# EAGLE design DOORLOCK_alter (EAGLE 7.5.0)

## Sheet 1 of 2
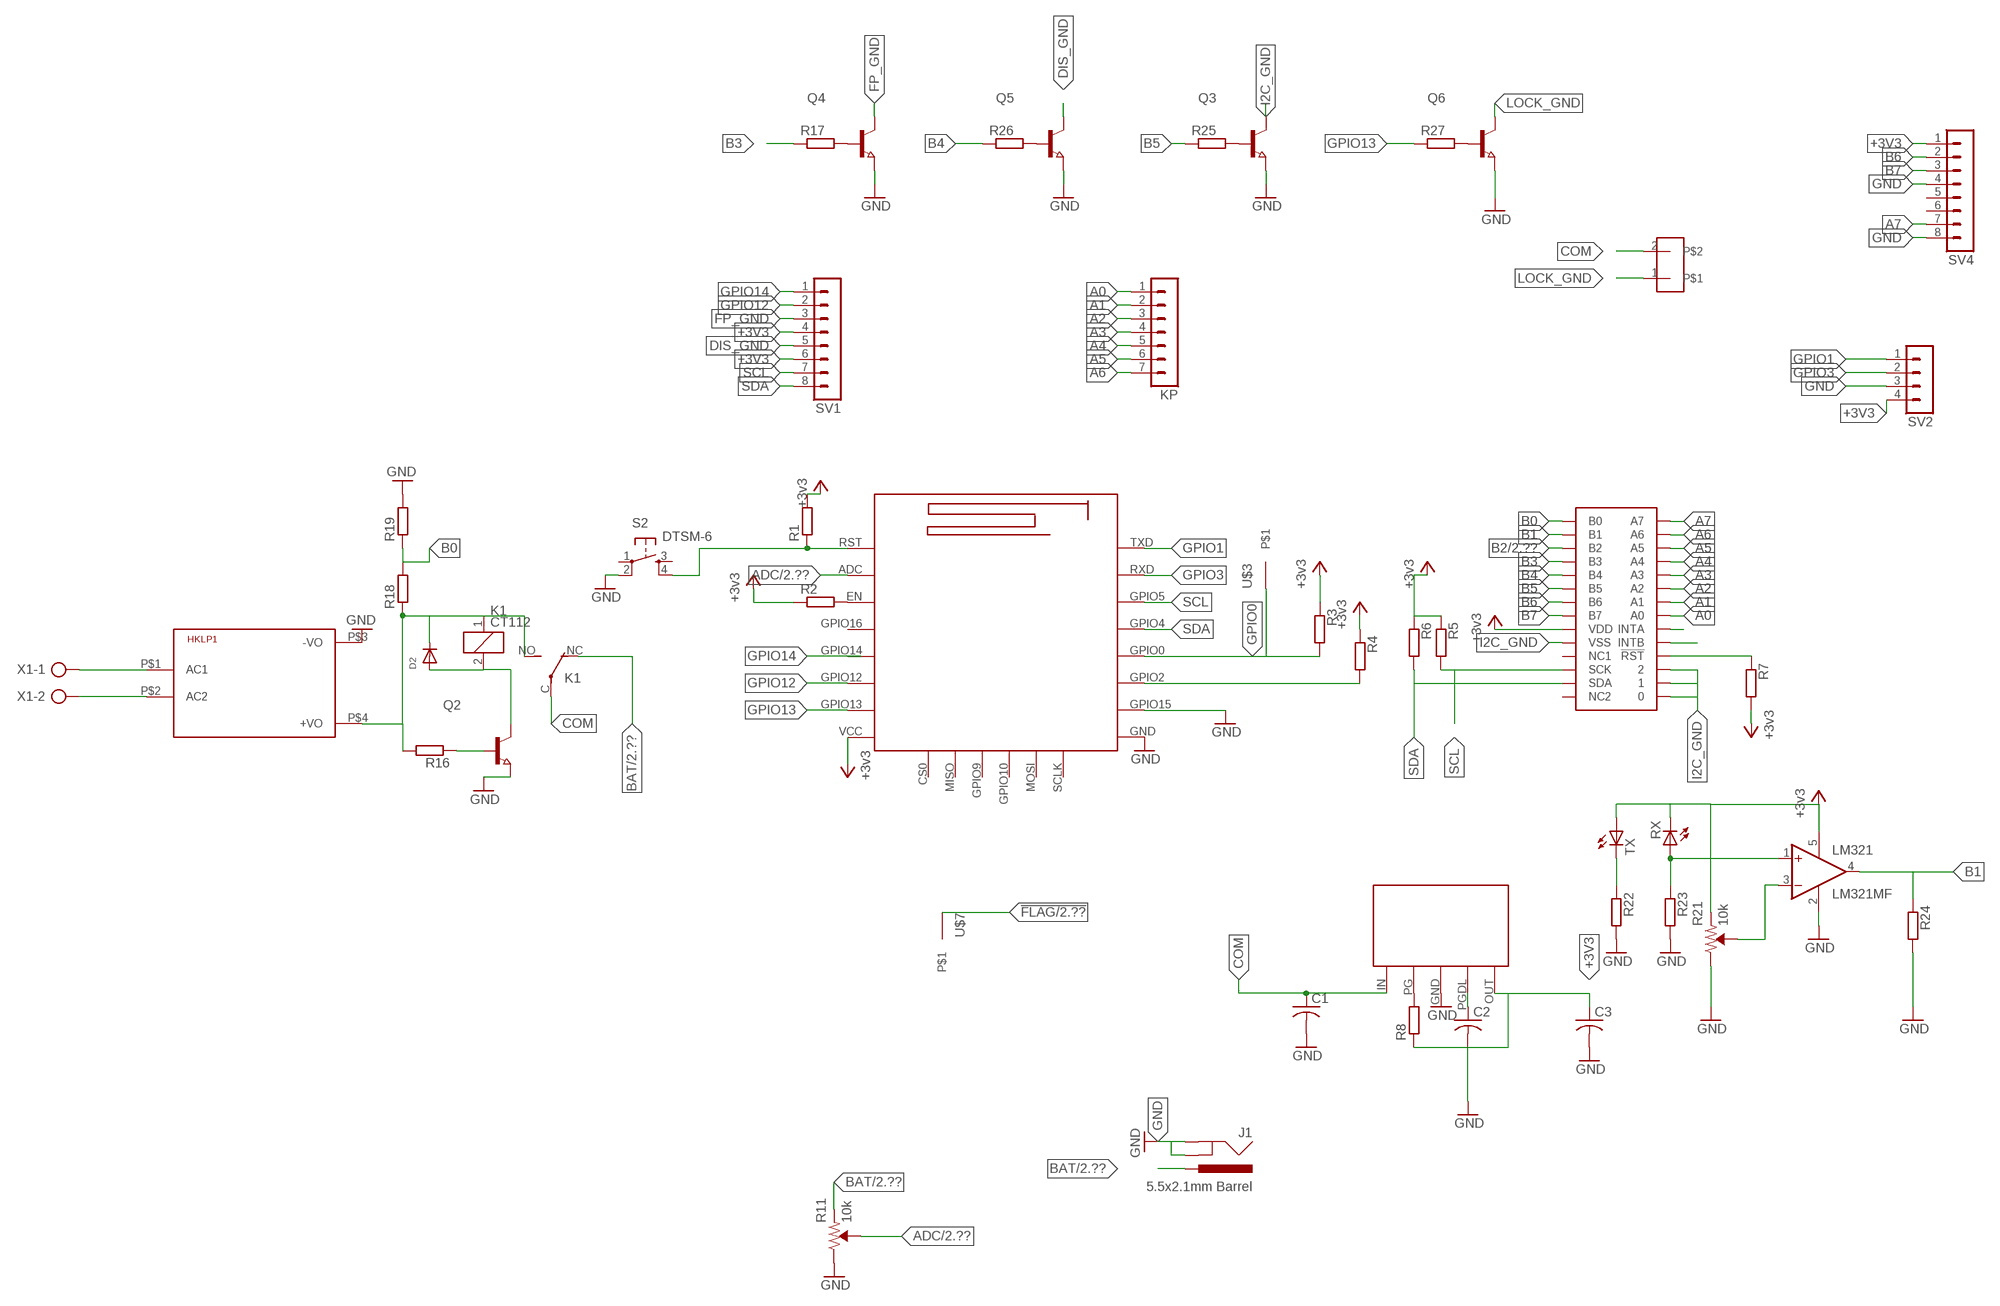
[diagram p0: schematic, sheet 1]

### Parts
C1  C-USC1206  [C1206]
C2  C-USC1206  [C1206]
C3  C-USC1206  [C1206]
D2  DIODESOD-123  [SOD-123]
HKLP1  HKLPM01  [HKLPM01]
J1  5.5x2.1mm Barrel  POWER_JACKSMD  [POWER_JACK_SMD]
K1  CT112  [CT-SLIM]
KP  MA07-1  [MA07-1]
LM321  LM321MF  [SOT23-5]
MP2014  MP2014  [MP2014]
Q2  NPN-TRANSISTOR_SOT89  [SOT89]
Q3  NPN-TRANSISTOR_SOT89  [SOT89]
Q4  NPN-TRANSISTOR_SOT89  [SOT89]
Q5  NPN-TRANSISTOR_SOT89  [SOT89]
Q6  NPN-TRANSISTOR_SOT89  [SOT89]
R1  R-EU_0204/2V  [0204V]
R2  R-EU_0204/2V  [0204V]
R3  R-EU_0204/2V  [0204V]
R4  R-EU_0204/2V  [0204V]
R5  R-EU_0204/2V  [0204V]
R6  R-EU_0204/2V  [0204V]
R7  R-EU_0204/2V  [0204V]
R8  R-EU_0204/2V  [0204V]
R11  10k  TRIMPOT-SMD-3MM-OPEN-1/10W-25%  [TRIMPOT-SMD-TC33X]
R16  R-EU_0204/2V  [0204V]
R17  R-EU_0204/2V  [0204V]
R18  R-EU_0204/2V  [0204V]
R19  R-EU_0204/2V  [0204V]
R21  10k  TRIMPOT-SMD-3MM-OPEN-1/10W-25%  [TRIMPOT-SMD-TC33X]
R22  R-EU_0204/2V  [0204V]
R23  R-EU_0204/2V  [0204V]
R24  R-EU_0204/2V  [0204V]
R25  R-EU_0204/2V  [0204V]
R26  R-EU_0204/2V  [0204V]
R27  R-EU_0204/2V  [0204V]
RX  LED5MM  [LED5MM]
S2  DTSM-6  [DTSM-6]
SV1  MA08-1  [MA08-1]
SV2  MA04-1  [MA04-1]
SV4  MA08-1  [MA08-1]
TX  LED5MM  [LED5MM]
U$1  ESP12E  [ESP-12E]
U$2  MCF23017  [MAX23017]
U$3  M1  [M1]
U$4  MALE2PIN  [MALE2PIN]
U$7  M1  [M1]
X1  AK500/2-H  [AK500/2-H]

### Nets
!FLAG [GPIO]: U$7.P$1 ; also sheet 2
+3V3 [GPIO]: C3.1 LM321.5(V+) MP2014.OUT R1.2 R2.1 R3.1 R4.1 R5.1 R6.1 R7.2 R8.1 R21.3(CCW) RX.K(C) SV1.4 SV1.6 SV2.4 SV4.1 TX.A U$1.VCC U$2.P$9(VDD) ; supply symbol labelled +3v3
+12V: D2.C HKLP1.P$4(+VO) K1.1 K1.NO(2:S) R16.2 R18.1 ; also sheet 2
A0 [GPIO]: KP.1 U$2.P$21(A0)
A1 [GPIO]: KP.2 U$2.P$22(A1)
A2 [GPIO]: KP.3 U$2.P$23(A2)
A3 [GPIO]: KP.4 U$2.P$24(A3)
A4 [GPIO]: KP.5 U$2.P$25(A4)
A5 [GPIO]: KP.6 U$2.P$26(A5)
A6 [GPIO]: KP.7 U$2.P$27(A6)
A7 [GPIO]: SV4.7 U$2.P$28(A7)
ADC [GPIO]: R11.2(WIPER) U$1.ADC ; also sheet 2
B0 [GPIO]: R18.2 R19.1 U$2.P$1(B0)
B1 [GPIO]: LM321.4(OUT) R24.1 U$2.P$2(B1)
B2 [GPIO]: U$2.P$3(B2) ; also sheet 2
B3 [GPIO]: R17.1 U$2.P$4(B3)
B4 [GPIO]: R26.1 U$2.P$5(B4)
B5 [GPIO]: R25.1 U$2.P$6(B5)
B6 [GPIO]: SV4.2 U$2.P$7(B6)
B7 [GPIO]: SV4.3 U$2.P$8(B7)
BAT [GPIO]: J1.VIN0(PWR) K1.NC(2:O) R11.3(CCW) ; also sheet 2
COM: C1.1 K1.C(2:P) MP2014.IN U$4.2
DIS_GND [GPIO]: Q5.2(C) SV1.5
FP_GND [GPIO]: Q4.2(C) SV1.3
GND [GPIO]: C1.2 C2.2 C3.2 HKLP1.P$3(-VO) J1.GND(GNDBREAK) J1.P$4(GND) LM321.2(V-) MP2014.GND Q2.3(E) Q3.3(E) Q4.3(E) Q5.3(E) Q6.3(E) R11.1(CW) R19.2 R21.1(CW) R22.2 R23.2 R24.2 S2.2 SV2.3 SV4.4 SV4.8 U$1.GND U$1.GPIO15 ; also sheet 2
GPIO0 [GPIO]: R3.2 U$1.GPIO0 U$3.P$1
GPIO1 [GPIO]: SV2.1 U$1.TXD
GPIO3 [GPIO]: SV2.2 U$1.RXD
GPIO12 [GPIO]: SV1.2 U$1.GPIO12
GPIO13 [GPIO]: R27.1 U$1.GPIO13
GPIO14 [GPIO]: SV1.1 U$1.GPIO14
I2C_GND [GPIO]: Q3.2(C) U$2.P$10(VSS) U$2.P$15 U$2.P$16 U$2.P$17
LOCK_GND: Q6.2(C) U$4.1
N$1 [GPIO]: R1.1 S2.4 U$1.RST
N$2: R2.2 U$1.EN
N$3 [AC]: HKLP1.P$1(AC1) X1.1
N$4 [GPIO]: R4.2 U$1.GPIO2
N$5 [GPIO]: LM321.3(-IN) R21.2(WIPER)
N$6: Q3.1(B) R25.2
N$7 [AC]: HKLP1.P$2(AC2) X1.2
N$9: R7.1 U$2.P$18(!RST)
N$10: U$2.P$19(INTB)
N$11: U$2.P$20(INTA)
N$12: MP2014.PG R8.2
N$13: C2.1 MP2014.PGDL
N$15: Q2.1(B) R16.1
N$16: Q6.1(B) R27.2
N$26: D2.A K1.2 Q2.2(C)
N$28: Q4.1(B) R17.2
N$30 [GPIO]: R22.1 TX.K(C)
N$31: Q5.1(B) R26.2
N$33 [GPIO]: LM321.1(+IN) R23.1 RX.A
SCL [GPIO]: R5.2 SV1.7 U$1.GPIO5 U$2.P$12(SCK)
SDA [GPIO]: R6.2 SV1.8 U$1.GPIO4 U$2.P$13(SDA)
Unconnected: S2.1 S2.3 SV4.5 SV4.6 U$1.CS0 U$1.GPIO9 U$1.GPIO10 U$1.GPIO16 U$1.MISO U$1.MOSI U$1.SCLK U$2.P$11(NC1) U$2.P$14(NC2)

## Sheet 2 of 2
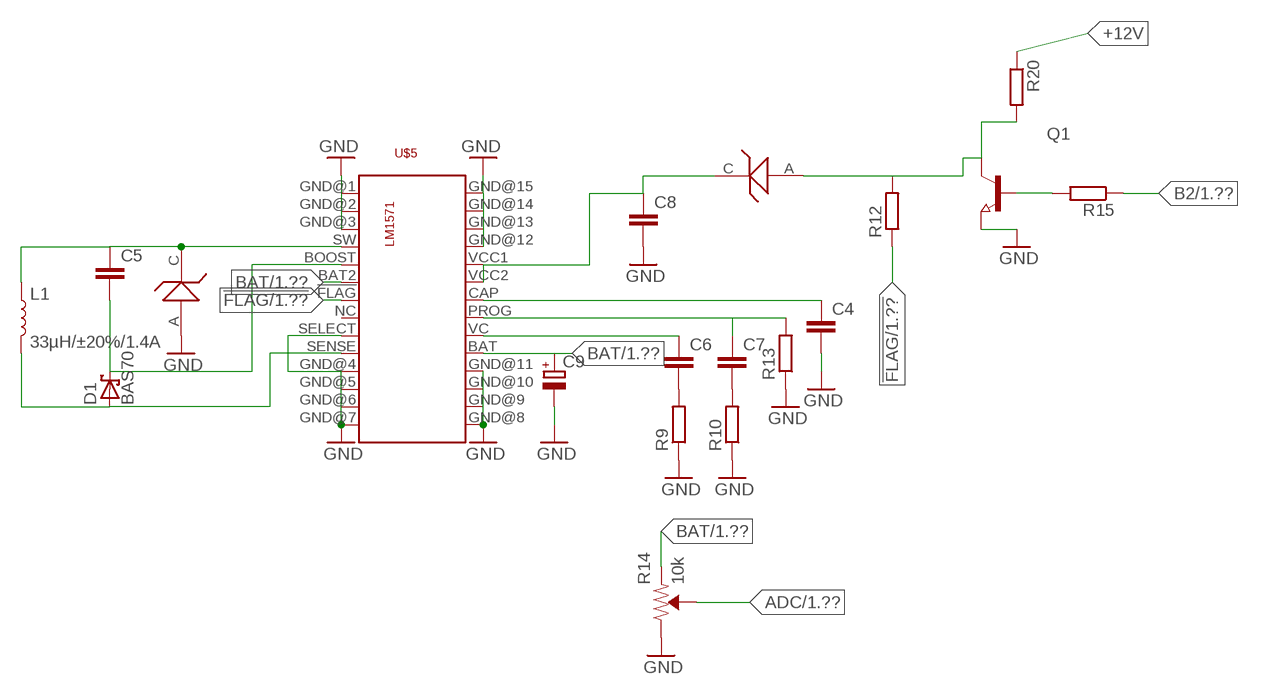
[diagram p1: schematic, sheet 2]

### Parts
C4  C-EUC0805  [C0805]
C5  C-EUC0805  [C0805]
C6  C-EUC0805  [C0805]
C7  C-EUC0805  [C0805]
C8  C-EUC0805  [C0805]
C9  CPOL-EUCT3216  [CT3216]
D1  BAS70  [SOT23]
D3  MBRM120T3  [MBRM120T3]
L1  33µH/±20%/1.4A  INDUCTOR-SRN6045-33UH  [SRN6045]
Q1  NPN-TRANSISTOR_SOT89  [SOT89]
R9  R-EU_0204/2V  [0204V]
R10  R-EU_0204/2V  [0204V]
R12  R-EU_0204/2V  [0204V]
R13  R-EU_0204/2V  [0204V]
R14  10k  TRIMPOT-SMD-3MM-OPEN-1/10W-25%  [TRIMPOT-SMD-TC33X]
R15  R-EU_0204/2V  [0204V]
R20  R-EU_0204/2V  [0204V]
U$5  LM1571  [LT1571]
U$6  MBRM120T3  [MBRM120T3]

### Nets
!FLAG [GPIO]: R12.1 U$5.!FLAG ; also sheet 1
+12V: R20.1 ; also sheet 1
ADC [GPIO]: R14.2(WIPER) ; also sheet 1
B2 [GPIO]: R15.1 ; also sheet 1
BAT [GPIO]: C9.+ R14.3(CCW) U$5.BAT U$5.BAT2 ; also sheet 1
GND [GPIO]: C4.2 C8.2 C9.- Q1.3(E) R9.1 R10.1 R13.1 R14.1(CW) U$5.GND@1 U$5.GND@2 U$5.GND@3 U$5.GND@4 U$5.GND@5 U$5.GND@6 U$5.GND@7 U$5.GND@8 U$5.GND@9 U$5.GND@10 U$5.GND@11 U$5.GND@12 U$5.GND@13 U$5.GND@14 U$5.GND@15 U$5.SELECT U$6.A ; also sheet 1
N$8 [GPIO]: Q1.1(B) R15.2
N$14: C8.1 D3.C U$5.VCC1 U$5.VCC2
N$17 [GPIO]: C4.1 U$5.CAP
N$18: D3.A Q1.2(C) R12.2 R20.2
N$19: D1.1(A) L1.2 U$5.SENSE
N$20: C5.1 L1.1 U$5.SW U$6.C
N$21: C5.2 D1.3(C) U$5.BOOST
N$22: C6.2 R9.2
N$23: C6.1 U$5.VC
N$24: C7.2 R10.2
N$25 [GPIO]: C7.1 R13.2 U$5.PROG
Unconnected: U$5.NC

## Library data of the parts
C1-C3 = adafruit:C-US: CAPACITOR, American symbol
C4-C8 = rcl:C-EU: CAPACITOR, European symbol
C9 = rcl:CPOL-EU: POLARIZED CAPACITOR, European symbol
D1 = diode:BAS70: Silicon Schottky Diodes General-purpose diode for high-speed switching
D2 = adafruit:DIODE: Diode SMADIODE - SMA Surface Mount Package 20V 1A Schottky Diode Digikey: 641-1014-6-ND DO-1N4148 - Through Hole Small Current Diode SOD-123 20V 1 A (.5mV Vf) Schottky Diode - Digikey: MBRX120TPMSCT-ND SOD-323 10V 570mA (.38mV Vf, 3ns) Schottky Diode - Digikey: ZLLS410CT-ND SOD-523 30V 30mA Schottky Diode (RB751S-40TE61) - Digikey: RB751S-40TE61CT-ND SOT23-R/W - SOT23 Package (R = Solder Paste/Reflow Ovens, W = Hand-Soldering) BAT54Film 40V 300mA - Digikey: 497-7162-1-ND
D3 U$6 = Alfred:MBRM120T3
HKLP1 = HKLPM01:HKLPM01
J1 = SparkFun-Connectors:POWER_JACK: Power Jack Connector This is the standard 5.5mm barrel jack for power. The PTH is the most common, proven, reliable, footprint. The Slot footprint only works if the mill layer is transmitted to the PCB fab house so be warned. Here are the connectors we sell at SparkFun: DC Barrel Power Jack/Connector <https://www.sparkfun.com/products/119> (PRT-00119) DC Barrel Power Jack/Connector (SMD) <https://www.sparkfun.com/products/12748> (PRT-12748) DC Barrel Jack Adapter - Breadboard Compatible <https://www.sparkfun.com/products/10811> (PRT-10811) It is used on this SparkFun product (and many, many others): SparkFun RedBoard - Programmed with Arduino <https://www.sparkfun.com/products/12757> (DEV-12757) Also, if you need a mating power supply or connector, please check these out: Wall Adapter Power Supply - 9VDC 650mA <https://www.sparkfun.com/products/298> (TOL-00298) DC Barrel Jack Adapter - Male <https://www.sparkfun.com/products/10287> (PRT-10287); PROD_ID: CONN-08106; SF_ID: PRT-12748
K1 = relay:CT112: ULTRA SMALL AUTOMOTIVE RELAY NAiS Slim 1c type en_ds_61205_0000.pdf; OC_FARNELL: unknown; OC_NEWARK: unknown
KP = con-lstb:MA07-1: PIN HEADER; OC_FARNELL: unknown; OC_NEWARK: unknown
L1 = SparkFun-Coils:INDUCTOR: Inductors Resist changes in electrical current. Basically a coil of wire. SparkFun Products: SparkFun Load Cell Amplifier - HX711 <https://www.sparkfun.com/products/13879> IOIO-OTG - V2.2 <https://www.sparkfun.com/products/13613>; PROD_ID: NDUC-11627
LM321 = linear:LM321?*: Low Power Single Op Amp Source: http://cache.national.com/ds/LM/LM321.pdf
MP2014 = Alfred:MP2014
Q1-Q6 = semicon-smd-ipc:NPN-TRANSISTOR_: NPN TRANSISTOR
R1-R8 R16-R19 R22-R27 = resistor:R-EU_: RESISTOR, European symbol
R9 R10 R12 R13 R15 R20 = rcl:R-EU_: RESISTOR, European symbol
R11 R14 R21 = SparkFun-Resistors:TRIMPOT: Trimming Potentiometer (Trimpot) Three-terminal potentiometers, with an adjustable wiper and two adjustable resistors. A pot can be used to create a configurable voltage divider, or as a variable resistor. "Trimpots" are a subset of potentiometers, usually intended for "set-and-forget" applications. They're often more delicate than standard potentiometers - rated for fewer turns. Variants PTH-KNOB - PTH Trimpot w/ finger-adjustable knob Trimpot 10K with Knob <https://www.sparkfun.com/products/9806> (COM-09806) Datasheet <http://www.sparkfun.com/datasheets/Components/General/TSR-3386.pdf> SMD-3MM-CLOSED-FRAME - SMD 3mm Square Closed-Frame Trimpot Used on e.g. EasyDriver - Stepper Motor Driver <https://www.sparkfun.com/products/12779> Datasheet <http://www.bitechnologies.com/pdfs/22.pdf> (22AR10KTR) SMD-5MM - SMD 5mm Square Closed-Frame Trimpot Used on e.g. IOIO-OTG - V2.2 <https://www.sparkfun.com/products/13613> Datasheet <http://www.vishay.com/docs/51008/ts53.pdf> (TS53YL502MR10) SMD-3MM-1/10W-25% - 3mm Square Open-Frame Trimpot Used on e.g. SparkFun Shapeoko <https://www.sparkfun.com/products/13899> Datasheet <http://www.bourns.com/docs/Product-Datasheets/TC33.pdf> (TC33X-2-103E); PROD_ID: RES-12428, RES-08048
RX TX = adafruit:LED: LED OSRAM: - CHIPLED LG R971, LG N971, LY N971, LG Q971, LY Q971, LO R971, LY R971 LH N974, LH R974 LS Q976, LO Q976, LY Q976 LO Q996 - Hyper CHIPLED LW Q18S LB Q993, LB Q99A, LB R99A - SideLED LS A670, LO A670, LY A670, LG A670, LP A670 LB A673, LV A673, LT A673, LW A673 LH A674 LY A675 LS A676, LA A676, LO A676, LY A676, LW A676 LS A679, LY A679, LG A679 - Hyper Micro SIDELED® LS Y876, LA Y876, LO Y876, LY Y876 LT Y87S - SmartLED LW L88C, LW L88S LB L89C, LB L89S, LG L890 LS L89K, LO L89K, LY L89K LS L896, LA L896, LO L896, LY L896 - TOPLED LS T670, LO T670, LY T670, LG T670, LP T670 LSG T670, LSP T670, LSY T670, LOP T670, LYG T670 LG T671, LOG T671, LSG T671 LB T673, LV T673, LT T673, LW T673 LH T674 LS T676, LA T676, LO T676, LY T676, LB T676, LH T676, LSB T676, LW T676 LB T67C, LV T67C, LT T67C, LS T67K, LO T67K, LY T67K, LW E67C LS E67B, LA E67B, LO E67B, LY E67B, LB E67C, LV E67C, LT E67C LW T67C LS T679, LY T679, LG T679 LS T770, LO T770, LY T770, LG T770, LP T770 LB T773, LV T773, LT T773, LW T773 LH T774 LS E675, LA E675, LY E675, LS T675 LS T776, LA T776, LO T776, LY T776, LB T776 LHGB T686 LT T68C, LB T68C - Hyper Mini TOPLED® LB M676 - Mini TOPLED Santana® LG M470 LS M47K, LO M47K, LY M47K Source: http://www.osram.convergy.de/
S2 = switch-tact:DTSM-6
SV1 SV4 = con-lstb:MA08-1: PIN HEADER; OC_FARNELL: unknown; OC_NEWARK: unknown
SV2 = con-lstb:MA04-1: PIN HEADER; OC_FARNELL: unknown; OC_NEWARK: unknown
U$1 = Alfred:ESP12E
U$2 = Alfred:MCF23017
U$3 U$7 = Alfred:M1
U$4 = Alfred:MALE2PIN
U$5 = Alfred:LM1571
X1 = con-ptr500:AK500/2-H: CONNECTOR Aug. 2004 / PTR Meßtechnik: Die Bezeichnung der Serie AK505 wurde geändert. Es handelt sich hierbei um AK500 in horizontaler Ausführung.; OC_FARNELL: unknown; OC_NEWARK: unknown

## Net classes
0 default: width 0.5 mm, drill 0.7 mm, clearance 0.3 mm
1 AC: width 1 mm, drill 0.7 mm, clearance 1 mm to class 0, clearance 0.3 mm
2 GPIO: width 0.2 mm, drill 0.7 mm, clearance 0.3 mm to class 0, clearance 0.3 mm to class 1, clearance 0.3 mm

## Board
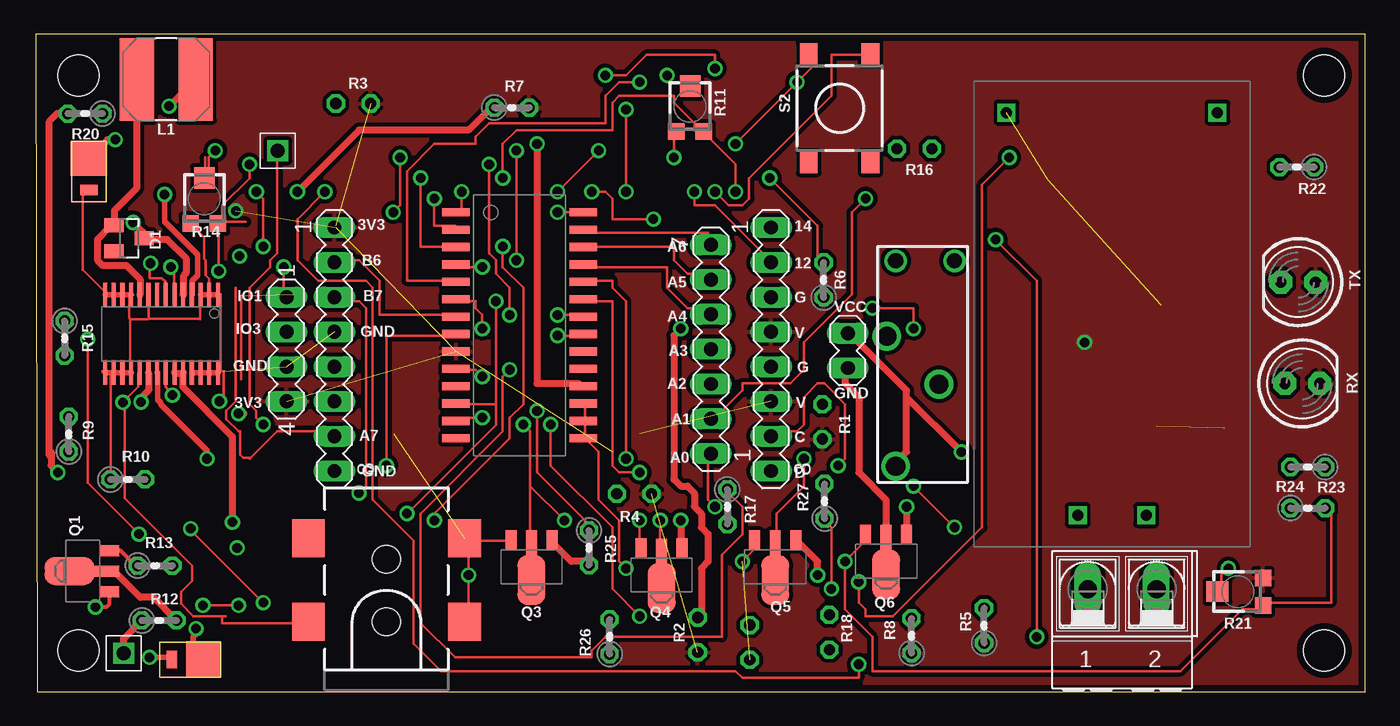
[diagram p2: board, top side]
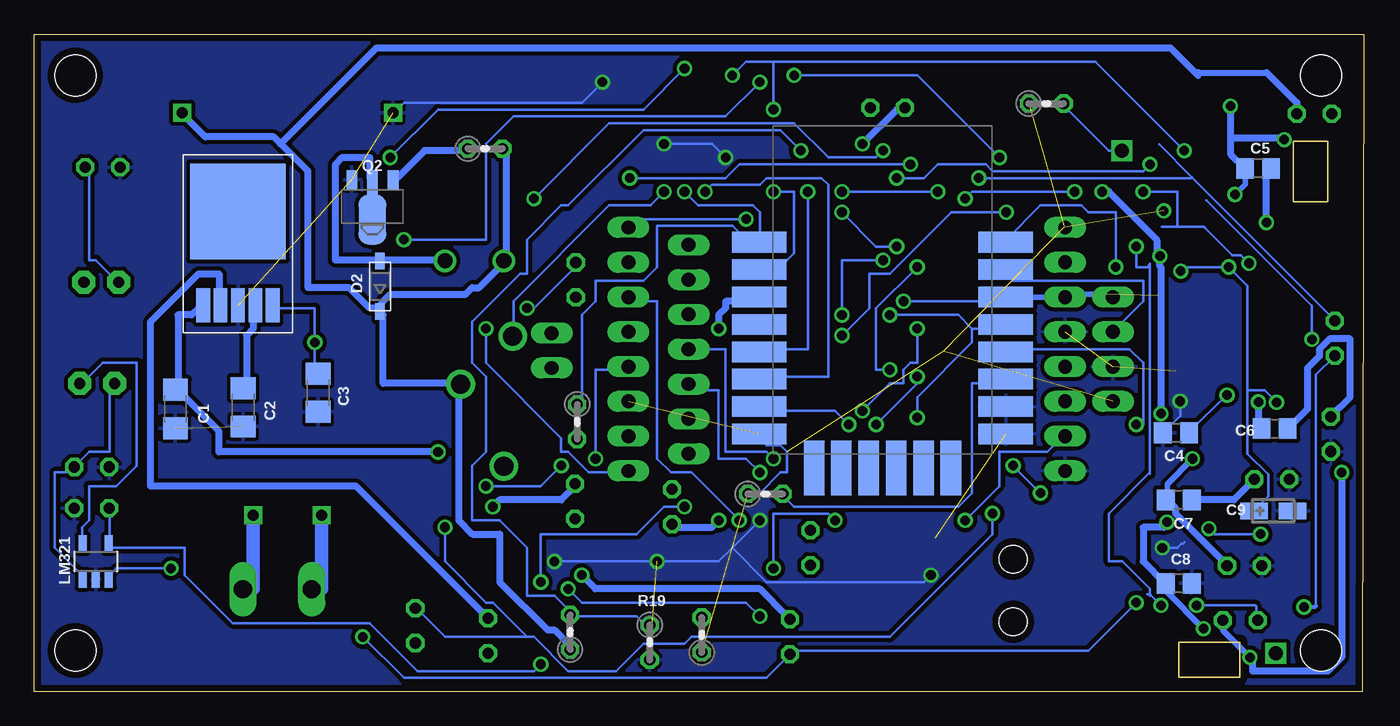
[diagram p3: board, bottom side, seen from below]

Size 97.1 x 48 mm. Coordinates in mm from the lower left corner, seen from the top.
Outline: 0,48 0.1,0 97.1,0 97.1,48 0,48
Copper layers (1*16): Top 0.035mm / dielectric 1.5mm / Bottom 0.035mm
Design rules "default *": minimum track width 0.2mm, minimum drill 0.4mm, track to track 0.1mm, track to pad 0.1mm, pad to pad 0.1mm, via to via 0.1mm, smd to smd 0.1mm, copper to edge 0.5mm, drill to drill 8mil, minimum pad ring 10mil, minimum via ring 8mil, stop-mask expansion 4mil, vias tented up to drill 0mil, thermal gap 10mil
Holes 3 mm at 94.1,45 3.1,45 3.1,3 94.1,3

### Footprints (pad centres in the part's own frame; a part is rotated, then mirrored left to right if it is on the bottom)
C1206 = smd 1.6 x 1.8: 1 -1.4,0; 2 1.4,0
C0805 = smd 1.3 x 1.5: 1 -0.95,0; 2 0.95,0
CT3216 = smd 2 x 1.2: + -1.4,0; - 1.4,0
SOT23 = smd 1 x 1.4: 1 -0.95,-1.1; 2 0.95,-1.1; 3 0,1.1
SOD-123 = smd 1.2 x 0.7: A 1.85,0; C -1.85,0
MBRM120T3 = smd 0.762 x 1.27: A 3.575,1.27 | smd 2.54 x 2.67: C 1.27,1.27
HKLPM01 = drill 0.8 square: P$1 -14.7,2.5; P$2 -14.7,-2.5; P$3 14.7,7.7; P$4 14.7,-7.7
POWER_JACK_SMD = smd 2.8 x 2.4: GND 0,-5.7; P$4 6.1,-5.7; VIN0 0,5.7; VIN1 6.1,5.7 | hole 2.032: 0,0; 4.572,0
CT-SLIM = drill 1.1: 1 -7.45,0; 2 -7.45,4.3 | drill 1.4: C 7.55,0; NC -1.95,-0.65; NO 1.55,3.15
MA07-1 = drill 1.016 long: 1 -7.62,0; 2 -5.08,0; 3 -2.54,0; 4 0,0; 5 2.54,0; 6 5.08,0; 7 7.62,0
SRN6045 = smd 2.5 x 6: 1 -2.175,0; 2 2.125,0
SOT23-5 = smd 0.6 x 1.2: 1 -0.95,-1.306; 2 0,-1.306; 3 0.95,-1.306; 4 0.95,1.306; 5 -0.95,1.306
MP2014 = smd 1 x 2.5: GND 0,0; IN -2.54,0; OUT 2.54,0; PG -1.27,0; PGDL 1.27,0 | smd 7 x 7: P$6 0,6.85
SOT89 = smd 0.8 x 1.4: 1 -1.499,-1.981; 3 1.499,-1.981 | smd 0.8 x 1.9: 2 0,-1.727 | smd 2.032 x 3.65: 2@1 0,0.94
0204V = drill 0.813 octagon: 1 -1.27,0; 2 1.27,0
TRIMPOT-SMD-TC33X = smd 1.2 x 1.2: 1 -1,-1.825; 3 1,-1.825 | smd 1.5 x 1.6: 2 0,1.5
LED5MM = drill 0.813 pad 1.676 octagon: A -1.27,0; K 1.27,0
DTSM-6 = smd 1.55 x 1.3: 1 -3.975,2.25; 2 3.975,2.25; 3 -3.975,-2.25; 4 3.975,-2.25
MA08-1 = drill 1.016 long: 1 -8.89,0; 2 -6.35,0; 3 -3.81,0; 4 -1.27,0; 5 1.27,0; 6 3.81,0; 7 6.35,0; 8 8.89,0
MA04-1 = drill 1.016 long: 1 -3.81,0; 2 -1.27,0; 3 1.27,0; 4 3.81,0
ESP-12E = smd 4 x 1.5: ADC -8.62,3.32; EN -8.62,1.32; GND 9.38,-8.68; GPIO0 9.38,-2.68; GPIO2 9.38,-4.68; GPIO4 9.38,-0.68; GPIO5 9.38,1.32; GPIO12 -8.62,-4.68; GPIO13 -8.62,-6.68; GPIO14 -8.62,-2.68; GPIO15 9.38,-6.68; GPIO16 -8.62,-0.68; RST -8.62,5.32; RXD 9.38,3.32; TXD 9.38,5.32; VCC -8.62,-8.68 | smd 1.5 x 4: CS0 -4.62,-11.16; GPIO9 -0.62,-11.16; GPIO10 1.38,-11.16; MISO -2.62,-11.16; MOSI 3.38,-11.16; SCLK 5.38,-11.16
MAX23017 = smd 0.6 x 2: P$1 0,0; P$2 1.27,0; P$3 2.54,0; P$4 3.81,0; P$5 5.08,0; P$6 6.35,0; P$7 7.62,0; P$8 8.89,0; P$9 10.16,0; P$10 11.43,0; P$11 12.7,0; P$12 13.97,0; P$13 15.24,0; P$14 16.51,0; P$15 16.51,9.3; P$16 15.24,9.3; P$17 13.97,9.3; P$18 12.7,9.3; P$19 11.43,9.3; P$20 10.16,9.3; P$21 8.89,9.3; P$22 7.62,9.3; P$23 6.35,9.3; P$24 5.08,9.3; P$25 3.81,9.3; P$26 2.54,9.3; P$27 1.27,9.3; P$28 0,9.3
M1 = drill 1.016 square: P$1 0,0
MALE2PIN = drill 1.016 long: 1 0,1.27; 2 0,-1.27
LT1571 = smd 0.3 x 1.8: !FLAG 3.81,-0.864; BAT 5.715,4.809; BAT2 3.175,-0.864; BOOST 2.54,-0.864; CAP 3.81,4.809; GND@1 0,-0.864; GND@2 0.635,-0.864; GND@3 1.27,-0.864; GND@4 6.35,-0.864; GND@5 6.985,-0.864; GND@6 7.62,-0.864; GND@7 8.255,-0.864; GND@8 8.255,4.809; GND@9 7.62,4.809; GND@10 6.985,4.809; GND@11 6.35,4.809; GND@12 1.905,4.809; GND@13 1.27,4.809; GND@14 0.635,4.809; GND@15 0,4.809; NC 4.445,-0.864; PROG 4.445,4.809; SELECT 5.08,-0.864; SENSE 5.715,-0.864; SW 1.905,-0.864; VC 5.08,4.809; VCC1 2.54,4.809; VCC2 3.175,4.809
AK500/2-H = drill 1.321 long: 1 -2.515,0; 2 2.515,0

### Placement (x,y rotation side)
C1  86.79,20.64 270 bottom
C2  81.84,20.76 270 bottom
C3  76.36,21.82 270 bottom
C4  13.7,18.9 180 bottom
C5  7.7,38.2 0 bottom
C6  6.5,19.2 0 bottom
C7  13.5,14 0 bottom
C8  13.5,7.9 0 bottom
C9  6.6,13.2 0 bottom
D1  6.8,33.1 270 top
D2  71.84,29.59 90 bottom
D3  13.5,3.6 180 top
HKLP1  78.6,27.58 90 top
J1  25.6,5.1 90 top
K1  62.8,24 270 top
KP  49.3,25 90 top
L1  9.5,44.7 180 top
LM321  92.6,9.5 0 bottom
MP2014  82.22,28.21 0 bottom
Q1  3.4,8.8 90 top
Q2  72.4,35.4 180 bottom
Q3  36.2,9.1 180 top
Q4  45.7,8.5 180 top
Q5  54,9.1 180 top
Q6  62.1,9.5 180 top
R1  57.44,19.71 270 bottom
R2  48.34,4.14 90 bottom
R3  23.18,42.94 0 bottom
R4  43.7,14.44 0 bottom
R5  69.26,4.82 90 top
R6  57.54,30.06 90 top
R7  34.76,42.64 0 top
R8  63.96,4.08 90 top
R9  2.4,18.8 90 top
R10  6.7,15.5 0 top
R11  47.78,42.72 0 top
R12  9,5.2 0 top
R13  8.7,9.2 0 top
R14  12.3,36 0 top
R15  2.1,25.8 270 top
R16  64.17,39.64 0 bottom
R17  50.5,13.5 270 top
R18  57.96,4.33 90 bottom
R19  52.14,3.59 270 bottom
R20  3.6,42.2 180 top
R21  87.8,7.3 90 top
R22  92.1,38.3 180 top
R23  92.9,16.4 180 top
R24  92.9,13.4 0 top
R25  40.4,10.5 270 top
R26  41.9,4 90 top
R27  57.6,13.9 90 top
RX  92.5,22.5 0 top
S2  58.7,42.6 90 top
SV1  53.7,25 270 top
SV2  18.3,25 270 top
SV4  21.8,25 270 top
TX  92.2,29.9 180 top
U$1  35.52,27.49 0 bottom
U$2  30.68,35 270 top
U$3  17.66,39.49 90 top
U$4  59.3,24.9 180 top
U$5  13.3,28.1 180 top
U$6  2.6,40.2 270 top
U$7  6.4,2.8 0 top
X1  79.34,7.47 0 top

### Tracks (layer width: path | path; a pad name or v marks a point on that pad's centre or on a via)
!FLAG  (via drill 0.7)
  Top 0.2: U$5.!FLAG 9.47,29 9.47,29.93 9.2,30.2 8.3,30.2 8.3,31.2 v8.38,31.27 | v12.2,6.3 v14.8,6.3 | v16.1,36.5 16.6,36 v16.6,32.5
  Top 0.5: U$7.P$1 6.4,3.87 R12.1
  Bottom 0.2: 15.6,31.15 15.6,31.25 | v12.2,6.3 7.9,6.3 7.85,6.25 7.85,5.25 R12.1 7.6,5 | v14.8,6.3 15.55,7.05 | 15.55,7.05 15.6,7.1 15.8,7.1 | 15.67,31.15 15.6,31.15 | 15.6,31.15 15.6,31 | 15.6,31 15.6,16 | 15.6,16 15.6,15.9 | v8.38,31.27 8.97,31.88 9.6,31.88 11.6,33.88 11.65,33.95 13.6,33.95 | 13.6,33.95 14.75,33.95 | 13.6,33.95 13.6,36.5 v16.1,36.5 | v16.6,32.5 16.6,31 15.6,31 | 15.6,16 18.6,13 18.6,9.5 17.6,9.5 15.6,7.5 15.6,7 15.55,7.05
+3V3  (via drill 0.7)  (7 unrouted)
  Top 0.2: v14.6,35.1 14.5,35.1
  Bottom 0.2: C3.1 76.6,23.5 v76.6,25.5 76.6,28 79.6,28 MP2014.OUT | LM321.5 93.6,11 93.6,12 93.1,12.5 93.1,15 91.1,15 89.6,16.5 89.6,24 92.1,24 93.6,22.5 RX.K | U$1.VCC 44.1,18.5 43.6,18 42.6,18 42.1,17.5 42.1,16 42.6,16 44.1,14.5 44.6,14.5 R4.1
  Bottom 0.406: SV4.1 21.9,33.89 21.9,34
  pour Top: 97.1,48 97.1,0 0.1,0 0.1,48
+12V
  Bottom 0.43: 12.1,45.2 7.07,45.2
  Bottom 0.5: 12.17,45.15 12.1,45.2 12.1,45 14.1,47 72.1,47 79.1,40 | 7.07,45.2 4.87,43 R20.1 | R16.2 62.6,39.5 62.6,31.5 K1.1 63.1,31 64.6,29.5 65.1,29.5 65.6,29 71.1,29 72.1,28 | 79.1,40 77.1,38 77.1,29.5 74.1,29.5 72.6,28 72.1,28 | 79.1,40 79.6,40.5 84.6,40.5 86.1,42 HKLP1.P$4 | R18.1 58.1,3.5 59.1,4.5 59.6,4.5 63.1,8 63.1,11.5 65.1,11.5 66.1,12.5 66.1,22 K1.NO 66.1,22.5 71.6,22.5 71.6,27.5 D2.C 72.1,28
A0  (via drill 0.7)
  Top 0.2: v38.1,26 39.6,26 U$2.P$21 | v26.1,35 26.6,35.5 v26.6,39 | v41.6,45 43.1,45 44.6,46.5 49.6,46.5 v49.6,45.5 | v71.1,39 69.1,37 69.1,12 62.6,5.5 60.6,5.5 60.6,6 60.1,6.5 v60.1,8 | v49.6,13.5 49.1,14 49.1,17 KP.1
  Bottom 0.2: v38.1,26 36.1,28 36.1,30.5 34.6,30.5 30.1,35 v26.1,35 | v26.6,39 32.6,45 v41.6,45 | v49.6,45.5 52.6,42.5 67.6,42.5 v71.1,39 | v60.1,8 60.1,11.5 53.1,11.5 51.1,13.5 v49.6,13.5
A1  (via drill 0.7)
  Top 0.2: v38.1,27.5 39.6,27.5 U$2.P$22 | v35.1,39.5 v35.1,31.5 | v60.6,36 59.6,35 59.6,29 56.1,25.5 56.1,23.5 55.1,22.5 51.6,22.5 51.6,22 49.6,20 KP.2
  Bottom 0.2: v38.1,27.5 38.1,31.5 v35.1,31.5 | v35.1,39.5 35.6,39 39.1,39 41.6,41.5 55.1,41.5 v60.6,36
A2  (via drill 0.7)
  Top 0.2: v44.1,16 42.6,16 42.1,16.5 42.1,28.5 40.1,28.5 U$2.P$23
  Bottom 0.2: v44.1,16 45.1,17 47.1,17 47.1,22 49.1,22 KP.3
A3  (via drill 0.7)
  Top 0.2: v43.1,17 43.1,28.5 42.1,29.5 42.1,30 40.1,30 U$2.P$24
  Bottom 0.2: v43.1,17 43.6,17.5 46.6,17.5 46.6,25 KP.4
A4
  Top 0.2: U$2.P$25 40.1,31 46.1,31 46.1,29.5 47.6,28 49.1,28 KP.5
A5
  Top 0.2: U$2.P$26 40.1,32.5 46.6,32.5 46.6,31.5 47.6,30.5 49.1,30.5 KP.6
A6
  Top 0.2: U$2.P$27 40.1,33.5 49.1,33.5 49.1,33 KP.7
A7  (via drill 0.7)
  Top 0.2: 14.6,29.5 14.6,21.2 13.9,20.5 13.9,19.9 14.8,19 14.9,19 14.9,17.3 15.12,17.07 15.6,17.07 | 15.67,17.07 15.6,17 15.6,17.07 | 15.6,17.07 15.67,17.07 | v38.1,35 U$2.P$28 | v34.1,32.5 34.1,31 35.6,29.5 35.6,21 34.6,20 34.6,18.5 29.1,13 v29.1,12.5 | 15.67,17.07 17.6,19 21.6,19 SV4.7
  Bottom 0.2: v38.1,35 35.6,32.5 v34.1,32.5 | v29.1,12.5 26.6,15 26.6,17.5 23.1,17.5 22.1,18.5 SV4.7
ADC  (via drill 0.7)
  Top 0.2: 12.35,39 12.35,37.5 R14.2 12.6,37.5 12.6,39 v13.1,39.5 | v46.1,45 46.1,44.5 47.6,44.5 R11.2 | v43.1,42.5 v43.1,36.5
  Bottom 0.2: v46.1,45 45.1,46 43.1,46 | 43.1,46 19.6,46 v13.1,39.5 | v43.1,36.5 41.6,36.5 41.6,32 42.1,31.5 43.6,31.5 44.1,31 U$1.ADC | 43.1,46 v43.1,42.5
B0  (via drill 0.7)
  Top 0.2: v31.1,36.5 31.1,35 U$2.P$1 | v41.1,39.5 v38.1,36.5
  Bottom 0.2: v38.1,36.5 v31.1,36.5 | v41.1,39.5 42.6,41 52.6,41 58.1,35.5 58.6,35.5 61.1,33 61.1,30.5 61.6,30.5 65.1,27 65.1,24 64.1,23 64.1,17.5 65.1,16.5 65.1,12.5 63.1,12.5 61.1,10.5 61.1,7 59.1,7 58.1,6 R18.2 57.6,5.5 53.1,5.5 52.6,5 R19.1
B1  (via drill 0.7)
  Top 0.2: v29.1,36 29.1,34 30.6,34 U$2.P$2 | v21.1,36.5 19.1,34.5 19.1,31.5 20.6,30 24.1,30 24.6,29.5 24.6,14 27.6,11 27.6,3.5 29.6,1.5 51.1,1.5 51.6,1 60.1,1 v60.1,2
  Bottom 0.2: R24.1 91.6,13 91.6,11 LM321.4 91.6,10.5 86.1,10.5 86.1,8.5 82.6,5 72.6,5 69.1,1.5 60.6,1.5 v60.1,2 | v29.1,36 28.6,36.5 v21.1,36.5
B2  (via drill 0.7)
  Top 0.2: v28.1,37.5 28.1,32.5 30.6,32.5 U$2.P$3
  Bottom 0.2: 14.92,39.95 12.54,37.56 | 12.54,37.56 2.1,27.12 R15.1 | v28.1,37.5 12.6,37.5 12.54,37.56
B3  (via drill 0.7)
  Top 0.2: v32.6,31 31.1,31 U$2.P$4 | v34.6,23.5 34.1,23 34.1,19 28.1,13 28.1,5 30.6,2.5 40.6,2.5 40.6,3 41.6,4 50.1,4 50.1,10 51.6,11.5 51.6,13.5 50.6,14.5 R17.1
  Bottom 0.2: v32.6,31 35.6,28 35.6,23.5 v34.6,23.5
B4  (via drill 0.7)
  Top 0.2: v3.77,25.73 3.77,15.25 v7.52,11.5 | v44.1,44.5 42.6,44.5 41.6,43.5 41.6,41.5 33.1,41.5 32.1,40.5 32.1,40 29.1,40 27.1,38 27.1,30 30.6,30 U$2.P$5 | v70.1,33 73.1,30 v73.1,4 | v16.6,6.5 11.6,11.5 v11.3,11.9
  Bottom 0.2: 11.47,35.88 3.77,28.18 v3.77,25.73 | v11.3,11.9 10.9,11.5 v7.52,11.5 | v44.1,44.5 46.6,42 62.1,42 64.1,40 64.1,33 v70.1,33 | v73.1,4 70.1,1 43.6,1 42.1,2.5 R26.1 41.6,3 20.1,3 v16.6,6.5
B5  (via drill 0.7)
  Top 0.2: v32.6,26.5 32.6,27.5 32.1,28 32.1,28.5 31.1,28.5 U$2.P$6 | v36.6,20.5 36.6,16 40.1,12.5 40.1,12 R25.1
  Bottom 0.2: v32.6,26.5 32.6,24 33.1,24 33.6,23.5 33.6,22.5 34.6,22.5 v36.6,20.5
B6
  Top 0.2: U$2.P$7 30.6,27.5 25.1,27.5 25.1,30 23.6,31.5 22.1,31.5 SV4.2
B7  (via drill 0.7)
  Top 0.2: v25.6,16.5 25.6,26 30.6,26 U$2.P$8 | v23.6,14.5 24.1,15 24.1,28 23.6,28.5 22.1,28.5 SV4.3
  Bottom 0.2: v23.6,14.5 v25.6,16.5
BAT  (via drill 0.7)
  Top 0.2: v13.35,30.7 13.35,34.12 R14.3 | U$5.BAT 7.47,23.25 7.47,22.25 v6.35,21.12 6.47,21.12 6.47,14.12 11.4,9.2 11.4,8.1 10.6,7.3 10.6,6.4 11.5,5.5 13.6,5.5 | U$5.BAT2 10.1,29 10.1,30.75 v9.85,31 | 13.6,5.5 13.85,5.5 | 15.32,34.3 13.4,34.3 R14.3 | 13.6,5.5 13.6,5 19.6,5 J1.VIN0 | v51.1,36.5 51.1,38.5 49.1,40.5 R11.3 48.6,40.5 48.1,41 48.1,41.5 46.6,43 46.6,43.5 42.6,43.5 42.1,43 42.1,41 35.1,41 34.1,40 v34.1,37.5 | v15.6,38.5 15.6,37.5 13.6,35.5 13.6,34.5 R14.3
  Bottom 0.2: 8.47,22 8.47,17.38 6.97,15.88 6.97,14.25 7.97,13.25 C9.+ | v6.35,21.12 7.22,22 8.47,22 | 8.47,22 8.47,29.62 v9.85,31 12.85,31 v13.35,30.7 | v51.1,36.5 52.1,35.5 55.1,35.5 62.1,28.5 62.1,26 K1.NC | v15.6,38.5 16.1,38 27.1,38 27.6,38.5 31.1,38.5 32.1,37.5 v34.1,37.5
COM  (via drill 0.7)
  Top 0.5: 63.6,21.5 63.6,17.5 63.1,17 63.1,16.5 K1.C | 63.6,21.5 63.6,22 59.6,26 U$4.2 | 63.6,21.5 v67.6,17.5
  Bottom 0.5: MP2014.IN 85.1,28 85.6,27.5 86.6,27.5 86.6,22.5 C1.1 86.6,22 83.6,19 83.6,17.5 v67.6,17.5
DIS_GND  (via drill 0.7)
  Top 0.2: v56.1,17 56.1,15 54.1,13 54.1,11 Q5.2
  Bottom 0.2: v56.1,17 56.1,23.5 54.1,23.5 SV1.5
FP_GND  (via drill 0.7)
  Top 0.2: v45.6,12.5 45.6,10.5 Q4.2
  Bottom 0.2: v45.6,12.5 49.1,16 50.6,16 51.6,17 51.6,28.5 53.6,28.5 SV1.3
GND  (via drill 0.7)  (7 unrouted)
  Top 0.2: U$5.GND@8 4.85,23.38 4.92,23.3 7,23.3 6.9,23.4 6.9,27.2 | 7.35,9.12 R13.1 | 12.72,29.12 U$5.GND@2 12.66,30.14 12.4,30.4 12.4,31.5 12.3,31.6 12.3,33.17 R14.1 | U$5.GND@1 13.47,29 13.47,23.47 U$5.GND@15 13.47,23.38 13.72,23.38 13.72,21.52 v13.4,21.2 | 5.47,23.29 5.47,15.5 R10.1 | U$5.GND@4 6.8,28.81 6.8,27.3 6.9,27.2 | 6.9,27.2 8.2,27.2 8.22,27.22 | 8.22,27.22 U$5.SELECT | U$6.A 3.4,36.16 3.4,30.8 5.04,29.16 U$5.GND@7 | U$5.GND@3 12,28.93 12,27.2 11.98,27.22 8.22,27.22 | v46.6,39 46.6,40.5 R11.1 | v51.1,40 v55.6,44.5 56.6,45.5 56.6,46.5 S2.2 | 31.6,11 34.6,11 Q3.3 | 31.6,11 v31.6,8.5 31.6,5.5 J1.GND | 31.6,11 J1.P$4 | R24.2 94.6,13 94.6,6.5 90.1,6.5 R21.1 89.6,6 88.1,6 83.6,1.5 61.1,1.5 61.1,4 59.1,6 v59.1,9.5 60.6,11 Q6.3 | v44.1,12.5 44.1,10.5 Q4.3 | v51.6,9.5 52.6,10.5 52.6,11 Q5.3
  Top 0.3: 7.35,9.12 6.18,10.3 Q1.3
  Top 0.4: U$5.GND@8 5.47,23.29 U$5.GND@9 U$5.GND@10 U$5.GND@11 | U$5.GND@7 U$5.GND@6 U$5.GND@5 U$5.GND@4 | U$5.GND@1 U$5.GND@2 U$5.GND@3 | U$5.GND@15 U$5.GND@14 U$5.GND@13 U$5.GND@12
  Bottom 0.2: C4.2 13.4,20.15 v13.4,21.2 | v14.7,10.5 13.6,10.5 13.3,10.8 13.2,10.8 13.1,10.9 | v46.6,39 47.6,40 v51.1,40 | 46.1,10.5 47.1,9.5 v51.6,9.5 v59.1,9.5 | 46.1,10.5 v44.1,12.5 | v31.6,8.5 32.1,8 43.6,8 46.1,10.5 | v55.6,44.5 57.1,43 70.1,43 70.6,42.5 HKLP1.P$3
  pour Bottom: 97.1,48 97.1,0 0.1,0 0.1,48
GPIO0  (via drill 0.7)
  Top 0.2: v16.6,19.5 16.1,20 16.1,20.5 15.6,21 15.6,29.5 17.1,31 17.1,31.5 17.6,32 17.6,39 U$3.P$1
  Bottom 0.2: R3.2 21.6,42.5 18.6,39.5 18.1,39.5 U$3.P$1 | v16.6,19.5 16.1,19.5 16.1,24 17.1,25 26.1,25 U$1.GPIO0
GPIO1  (via drill 0.7)
  Top 0.2: v18.1,31 18.1,29 SV2.1
  Bottom 0.2: v18.1,31 18.1,35 20.1,35 20.6,35.5 23.6,35.5 26.1,33 U$1.TXD
GPIO3
  Bottom 0.2: SV2.2 18.1,26.5 16.1,28.5 16.1,30 25.6,30 26.1,30.5 U$1.RXD
GPIO12  (via drill 0.7)
  Top 0.2: v48.1,36.5 48.1,35.5 49.6,35.5 53.6,31.5 SV1.2
  Bottom 0.2: v48.1,36.5 47.6,37 44.1,37 43.6,37.5 39.6,37.5 39.1,37 39.1,23 44.1,23 U$1.GPIO12
GPIO13  (via drill 0.7)
  Top 0.2: v58.1,7.5 58.1,12 57.6,12.5 R27.1 | v44.1,5.5 42.1,7.5 42.1,12 37.6,16.5 v37.6,19.5
  Bottom 0.2: v58.1,7.5 57.1,6.5 45.1,6.5 v44.1,5.5 | v37.6,19.5 38.6,20.5 44.1,20.5 U$1.GPIO13
GPIO14  (via drill 0.7)
  Top 0.2: v45.1,34.5 42.1,34.5 42.1,36 41.6,36.5 v40.6,36.5
  Bottom 0.2: v45.1,34.5 53.1,34.5 53.6,34 SV1.1 | v40.6,36.5 40.6,25 44.1,25 U$1.GPIO14
I2C_GND  (via drill 0.7)
  Top 0.2: 40.1,18.5 40.1,19.5 U$2.P$16 40.1,20 40.1,21 U$2.P$17 | 36.1,15 36.1,19 v35.6,19.5 | 36.1,15 36.1,11 Q3.2 | v32.6,23 32.1,23.5 31.1,23.5 U$2.P$10 | 40.1,18.5 41.1,17.5 41.1,14 42.6,12.5 42.6,9.5 v43.1,9 | 36.1,15 v38.6,12.5 | 40.1,18.5 U$2.P$15
  Bottom 0.2: v35.6,19.5 32.6,22.5 v32.6,23 | v43.1,9 43.1,13 39.1,13 v38.6,12.5
LOCK_GND
  Top 0.5: Q6.2 62.1,14 60.1,16 60.1,21.5 59.1,22.5 59.1,23.5 U$4.1
N$1  (via drill 0.7)
  Top 0.2: v49.6,36.5 50.6,35.5 51.6,35.5 52.1,36 52.1,37.5 58.1,43.5 58.1,46.5 60.6,46.5 S2.4
  Bottom 0.2: v49.6,36.5 48.6,35.5 44.6,35.5 44.1,35 44.1,33 U$1.RST 44.6,33 45.1,33 46.1,34 51.6,34 51.6,31 52.6,30 56.1,30 56.1,28.5 57.1,27.5 57.1,21 R1.1
N$2  (via drill 0.7)
  Top 0.5: v47.1,26.5 46.6,26 46.6,15.5 47.1,15 47.6,15 48.1,14.5 48.1,13.5 48.6,13 48.6,12 49.1,11.5 49.1,9.5 48.6,9 48.6,5.5 R2.2
  Bottom 0.5: v47.1,26.5 47.1,27.5 46.6,28 46.6,28.5 44.6,28.5 U$1.EN
N$3
  Bottom 1: HKLP1.P$1 76.1,7.5 76.6,7.5 X1.1
N$4
  Bottom 0.2: R4.2 42.1,14 41.6,13.5 29.6,13.5 28.6,14.5 28.6,22.5 26.6,22.5 U$1.GPIO2
N$5  (via drill 0.7)
  Top 0.2: v87.1,9 86.6,8.5 86.6,7.5 R21.2
  Bottom 0.2: v87.1,9 91.1,9 91.6,8.5 LM321.3
N$6
  Top 0.5: Q3.1 37.6,11 39.1,9.5 40.1,9.5 R25.2
N$7
  Bottom 1: HKLP1.P$2 81.1,7.5 81.6,7.5 X1.2
N$8  (via drill 0.7)
  Top 0.3: Q1.1 5.38,6.41 5.15,6.17 v4.35,6.17
  Bottom 0.2: 3.48,6.25 3.48,23.12 2.1,24.5 R15.2
  Bottom 0.3: 3.48,6.25 3.55,6.17 v4.35,6.17
N$9  (via drill 0.7)
  Top 0.5: v14.8,20.3 15.2,20.3 | v36.6,40 36.6,22.5 39.6,22.5 U$2.P$18 | v19.1,36.5 23.6,41 31.6,41 33.1,42.5 R7.1
  Bottom 0.5: v14.8,20.3 14.8,30.98 14.88,31.05 v14.88,31.8 15.1,32 15.1,33 18.6,36.5 v19.1,36.5 | v36.6,40 34.1,42.5 33.6,42.5 R7.1
N$12
  Bottom 0.5: MP2014.PG 83.6,28.5 83.6,30.5 85.1,30.5 88.6,27 88.6,15 73.6,15 64.1,5.5 R8.2
N$13
  Bottom 0.5: C2.1 81.6,22.5 81.6,26 81.1,26.5 81.1,28 MP2014.PGDL
N$14  (via drill 0.7)
  Top 0.4: D3.C 12.3,2.4 11.5,3.2 11.5,4 11.7,4.2 v11.7,4.6
  Top 0.5: v14.35,12.38 14.35,18.62 10.72,22.25 10.72,23.25 | 10.72,23.25 U$5.VCC1 | U$5.VCC2 10.22,23.25 10.72,23.25
  Bottom 0.4: v11.7,4.6 14.45,7.35 C8.1
  Bottom 0.5: 14.35,8 C8.1 | 14.8,7.9 C8.1 | C8.1 14.6,8 16.1,9.5 16.1,12 14.6,12 v14.35,12.38
N$15
  Bottom 0.5: Q2.1 70.6,37.5 68.6,39.5 65.6,39.5 R16.1
N$16  (via drill 0.7)
  Top 0.5: v63.6,13.5 63.6,11.5 Q6.1
  Bottom 0.5: v63.6,13.5 63.1,14 58.6,14 57.6,15 R27.2
N$17  (via drill 0.7)
  Top 0.2: v9.97,21.65 9.47,22.25 9.47,23.25 U$5.CAP
  Bottom 0.2: v9.97,21.65 12.72,19 C4.1
N$18  (via drill 0.7)
  Top 0.4: D3.A 9.75,2.5 v8.3,2.5
  Top 0.5: R12.2 10.22,5.25 8.6,6.88 7.62,6.88 5.7,8.8 Q1.2 | 0.97,17.25 0.97,17.5 | 0.97,17.5 0.97,41.65 1.53,42.2 R20.2 | v1.6,16 1.1,16.5 1.1,17.5 0.97,17.5
  Bottom 0.4: v8.3,2.5 10.27,4.47 R12.2
  Bottom 0.5: v1.6,16 1.6,2.5 2.6,1.5 8.1,1.5 8.1,2.5 v8.3,2.5
N$19
  Top 0.5: L1.2 7.35,44.62 7.35,36.75 5.72,35.12 5.72,34.12 D1.1 5.47,34 4.47,33 4.47,31.5 4.85,31.12 6.6,31.12 7.6,30.12 7.6,29 U$5.SENSE
N$20  (via drill 0.7)
  Top 0.4: U$6.C 4.7,39.76 | U$5.SW 11.4,30 11.8,30.4 11.8,31.9 9.4,34.3 v9.4,36.3
  Top 0.5: L1.1 v9.72,42.75 | 4.7,39.76 5.24,40.3 v5.8,40.3
  Bottom 0.4: C5.1 8.65,37.05 v9.4,36.3
  Bottom 0.5: v9.72,42.75 9.72,40.4 | 9.72,40.4 9.72,39.25 8.72,38.25 C5.1 | v5.8,40.3 5.9,40.4 9.72,40.4
N$21  (via drill 0.7)
  Top 0.5: U$5.BOOST 10.72,29 10.8,29.07 10.8,30.4 11,30.6 11,31.6 9.6,33 7.97,33 D1.3 8.22,33.12 v7.1,34.25
  Bottom 0.5: v7.1,34.25 7.1,37.88 6.85,38.12 C5.2
N$22
  Bottom 0.5: C6.2 5.47,19.25 4.1,20.62 4.1,23.62 3.23,24.5 3.23,25 2.48,25.75 0.97,25.75 0.97,21.5 2.35,20.12 R9.2
N$23  (via drill 0.7)
  Top 0.5: U$5.VC 8.22,23.25 8.22,22 7.67,21.45 v7.67,21.15
  Bottom 0.5: 7.47,19.25 C6.1 7.67,19.43 v7.67,21.15
N$24
  Bottom 0.5: C7.2 9.47,14 R10.2
N$25  (via drill 0.7)
  Top 0.4: v12.5,17 12.5,17.6 9.1,21 9.1,21.1 8.9,21.3 8.9,23.25 U$5.PROG
  Bottom 0.4: 14.35,14 14.35,15.15 v12.5,17
  Bottom 0.5: C7.1 14.35,14 13.72,13.38 13.72,13 9.97,9.25 R13.2
N$26
  Bottom 0.5: K1.2 67.1,31.5 71.6,31.5 D2.A 72.1,31.5 75.1,31.5 75.1,38.5 74.6,39 72.6,39 72.6,37.5 Q2.2
N$28  (via drill 0.7)
  Top 0.5: v47.1,12.5 47.1,10.5 Q4.1
  Bottom 0.5: v47.1,12.5 47.6,12 50.1,12 R17.2
N$30
  Bottom 0.2: R22.1 93.1,38 93.1,31.5 92.6,31.5 91.1,30 TX.K
N$31  (via drill 0.7)
  Top 0.5: v57.1,8.5 57.1,9.5 55.6,11 Q5.1
  Bottom 0.5: v57.1,8.5 56.1,7.5 44.1,7.5 42.1,5.5 R26.2
N$33
  Bottom 0.2: LM321.1 93.6,8.5 95.6,10.5 95.6,16 94.6,16 R23.1 94.1,16.5 93.1,17.5 91.6,17.5 91.6,22.5 RX.A
SCL  (via drill 0.7)  (1 unrouted)
  Top 0.2: 15,28.9 15,22.8 | 33.6,21 31.1,21 U$2.P$12 | v33.6,28.5 33.6,21 | v27.1,13 33.6,19.5 33.6,21 | v58.6,16.5 59.1,17 59.1,21 57.6,22.5 57.1,22.5 56.1,21.5 56.1,19.5 55.6,19 54.1,19 SV1.7 | v67.1,12 v64.1,15
  Bottom 0.2: v33.6,28.5 26.6,28.5 U$1.GPIO5 | 61.1,4 60.6,4 58.1,1.5 54.6,1.5 52.6,3.5 49.6,3.5 49.1,4 34.6,4 27.1,11.5 v27.1,13 | 61.1,4 67.1,4 69.1,6 R5.2 | v58.6,16.5 60.1,15 v64.1,15 | v67.1,12 67.1,9.5 64.1,6.5 63.6,6.5 61.1,4
  Bottom 0.406: U$1.GPIO5 21.6,28.81 21.6,29 18.8,29
SDA  (via drill 0.7)
  Top 0.2: v32.6,20 31.1,20 U$2.P$13 | v61.1,28 64.1,28 v64.1,26.5 | v34.6,27.5 34.6,29.5 33.6,30.5 33.6,31.5 33.1,32 v33.1,38.5 | v53.6,37.5 57.1,34 57.1,31.5 R6.2
  Bottom 0.2: v32.6,20 32.6,21.5 28.6,25.5 28.6,26.5 | 28.6,26.5 26.6,26.5 U$1.GPIO4 | v61.1,28 60.6,28 57.6,31 R6.2 | v64.1,26.5 64.1,24 58.6,18.5 58.6,17.5 58.1,17.5 56.6,16 54.1,16 SV1.8 | 28.6,26.5 29.6,27.5 v34.6,27.5 | v33.1,38.5 45.6,38.5 46.6,37.5 v53.6,37.5

### Text on the board
tPlace: IO1 | IO3 | GND
tNames: 3V3 | 14 | A6 | B6 | 12 | A5 | B7 | G | VCC | A4 | GND | V | A3 | G | A2 | 3V3 | V | GND | A1 | A7 | C | A0 | GND | D